# EAGLE schematic blinkenkringel (EAGLE 6.4)
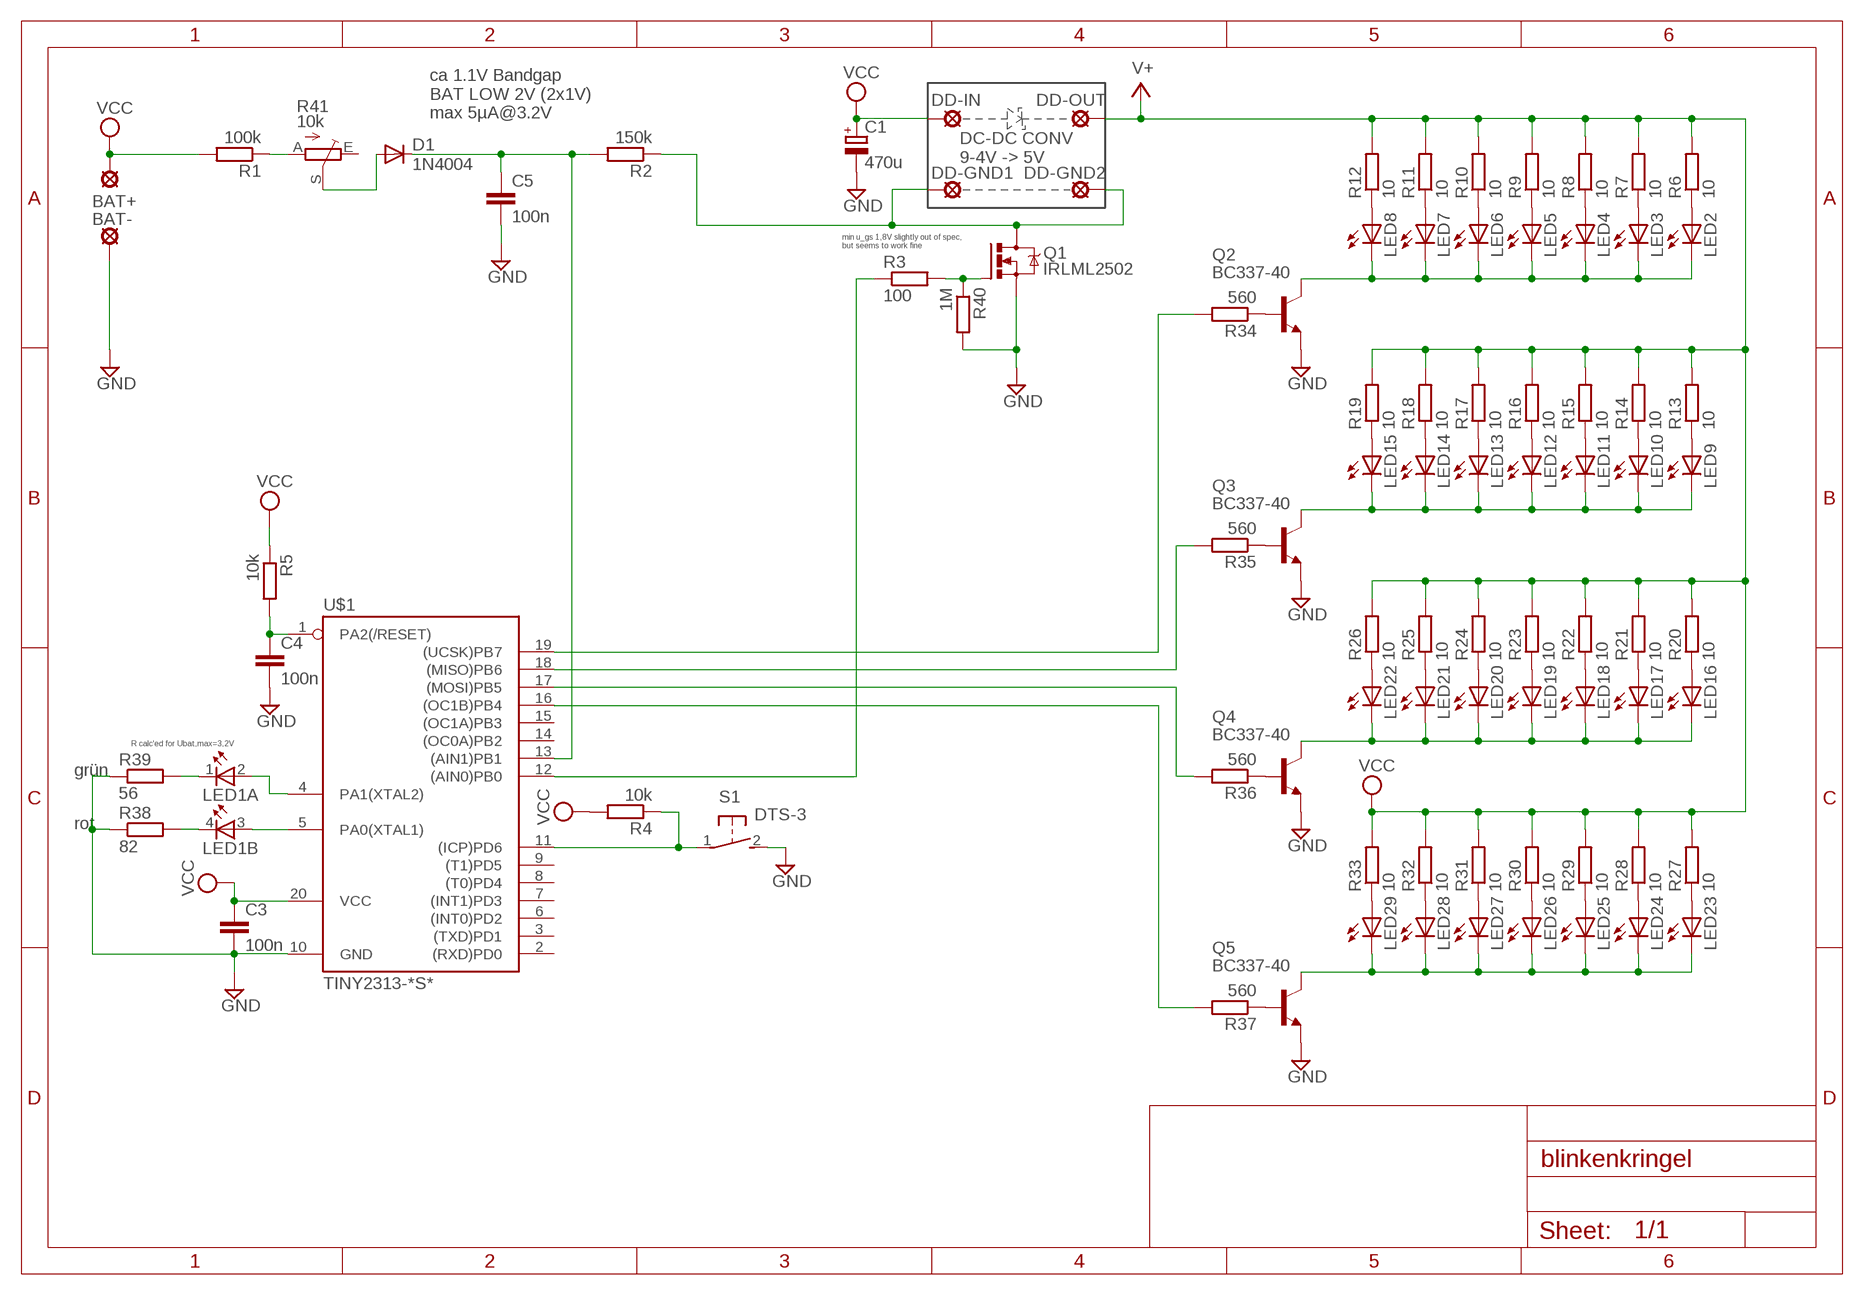
[diagram p0: schematic, sheet 1]

## Parts
BAT+  MCS10B  [MCS10B]
BAT-  MCS10B  [MCS10B]
C1  470u  CPOL-EUE5-8.5  [E5-8,5]
C3  100n  C-EU025-024X044  [C025-024X044]
C4  100n  C-EU025-024X044  [C025-024X044]
C5  100n  C-EU025-024X044  [C025-024X044]
D1  1N4004  [DO41-10]
DD-GND1  MCS10B  [MCS10B]
DD-GND2  MCS10B  [MCS10B]
DD-IN  MCS10B  [MCS10B]
DD-OUT  MCS10B  [MCS10B]
LED1  TOPLED-2--  [P-LCC-4-2]
LED2  LEDCHIPLED_0805  [CHIPLED_0805]
LED3  LEDCHIPLED_0805  [CHIPLED_0805]
LED4  LEDCHIPLED_0805  [CHIPLED_0805]
LED5  LEDCHIPLED_0805  [CHIPLED_0805]
LED6  LEDCHIPLED_0805  [CHIPLED_0805]
LED7  LEDCHIPLED_0805  [CHIPLED_0805]
LED8  LEDCHIPLED_0805  [CHIPLED_0805]
LED9  LEDCHIPLED_0805  [CHIPLED_0805]
LED10  LEDCHIPLED_0805  [CHIPLED_0805]
LED11  LEDCHIPLED_0805  [CHIPLED_0805]
LED12  LEDCHIPLED_0805  [CHIPLED_0805]
LED13  LEDCHIPLED_0805  [CHIPLED_0805]
LED14  LEDCHIPLED_0805  [CHIPLED_0805]
LED15  LEDCHIPLED_0805  [CHIPLED_0805]
LED16  LEDCHIPLED_0805  [CHIPLED_0805]
LED17  LEDCHIPLED_0805  [CHIPLED_0805]
LED18  LEDCHIPLED_0805  [CHIPLED_0805]
LED19  LEDCHIPLED_0805  [CHIPLED_0805]
LED20  LEDCHIPLED_0805  [CHIPLED_0805]
LED21  LEDCHIPLED_0805  [CHIPLED_0805]
LED22  LEDCHIPLED_0805  [CHIPLED_0805]
LED23  LEDCHIPLED_0805  [CHIPLED_0805]
LED24  LEDCHIPLED_0805  [CHIPLED_0805]
LED25  LEDCHIPLED_0805  [CHIPLED_0805]
LED26  LEDCHIPLED_0805  [CHIPLED_0805]
LED27  LEDCHIPLED_0805  [CHIPLED_0805]
LED28  LEDCHIPLED_0805  [CHIPLED_0805]
LED29  LEDCHIPLED_0805  [CHIPLED_0805]
Q1  IRLML2502  [MICRO3]
Q2  BC337-40  [TO92]
Q3  BC337-40  [TO92]
Q4  BC337-40  [TO92]
Q5  BC337-40  [TO92]
R1  100k  R-EU_0207/7  [0207/7]
R2  150k  R-EU_0207/7  [0207/7]
R3  100  R-EU_0207/7  [0207/7]
R4  10k  R-EU_0207/7  [0207/7]
R5  10k  R-EU_0207/7  [0207/7]
R6  10  R-EU_0207/7  [0207/7]
R7  10  R-EU_0207/7  [0207/7]
R8  10  R-EU_0207/7  [0207/7]
R9  10  R-EU_0207/7  [0207/7]
R10  10  R-EU_0207/7  [0207/7]
R11  10  R-EU_0207/7  [0207/7]
R12  10  R-EU_0207/7  [0207/7]
R13  10  R-EU_0207/7  [0207/7]
R14  10  R-EU_0207/7  [0207/7]
R15  10  R-EU_0207/7  [0207/7]
R16  10  R-EU_0207/7  [0207/7]
R17  10  R-EU_0207/7  [0207/7]
R18  10  R-EU_0207/7  [0207/7]
R19  10  R-EU_0207/7  [0207/7]
R20  10  R-EU_0207/7  [0207/7]
R21  10  R-EU_0207/7  [0207/7]
R22  10  R-EU_0207/7  [0207/7]
R23  10  R-EU_0207/7  [0207/7]
R24  10  R-EU_0207/7  [0207/7]
R25  10  R-EU_0207/7  [0207/7]
R26  10  R-EU_0207/7  [0207/7]
R27  10  R-EU_0207/7  [0207/7]
R28  10  R-EU_0207/7  [0207/7]
R29  10  R-EU_0207/7  [0207/7]
R30  10  R-EU_0207/7  [0207/7]
R31  10  R-EU_0207/7  [0207/7]
R32  10  R-EU_0207/7  [0207/7]
R33  10  R-EU_0207/7  [0207/7]
R34  560  R-EU_0207/7  [0207/7]
R35  560  R-EU_0207/7  [0207/7]
R36  560  R-EU_0207/7  [0207/7]
R37  560  R-EU_0207/7  [0207/7]
R38  82  R-EU_0207/7  [0207/7]
R39  56  R-EU_0207/7  [0207/7]
R40  1M  R-EU_0207/7  [0207/7]
R41  10k  TRIM_EU-CA9V  [CA9V]
S1  DTS-3  [DTS-3]
U$1  TINY2313-*S*  [SO20L$]

## Nets
GND: BAT-.MP C1.- C3.2 C4.2 C5.2 Q1.2(S) Q2.1(E) Q3.1(E) Q4.1(E) Q5.1(E) R38.1 R39.1 R40.2 S1.2 U$1.10(GND)
N$1: C4.1 R5.2 U$1.1(PA2(/RESET))
N$2: LED2.A R6.1
N$3: LED3.A R7.1
N$4: C5.1 D1.C R2.2 U$1.13((AIN1)PB1)
N$5: DD-GND1.MP DD-GND2.MP Q1.3(D) R2.1
N$6: Q1.1(G) R3.2 R40.1
N$7: LED4.A R8.1
N$8: LED5.A R9.1
N$9: LED6.A R10.1
N$10: LED7.A R11.1
N$11: LED8.A R12.1
N$12: Q2.2(B) R34.1
N$13: LED9.C LED10.C LED11.C LED12.C LED13.C LED14.C LED15.C Q3.3(C)
N$14: LED9.A R13.1
N$15: LED10.A R14.1
N$16: LED11.A R15.1
N$17: LED12.A R16.1
N$18: LED13.A R17.1
N$19: LED14.A R18.1
N$20: LED15.A R19.1
N$21: Q3.2(B) R35.1
N$22: LED16.C LED17.C LED18.C LED19.C LED20.C LED21.C LED22.C Q4.3(C)
N$23: LED16.A R20.1
N$24: LED17.A R21.1
N$25: LED18.A R22.1
N$26: LED19.A R23.1
N$27: LED20.A R24.1
N$28: LED21.A R25.1
N$29: LED22.A R26.1
N$30: Q4.2(B) R36.1
N$31: LED23.C LED24.C LED25.C LED26.C LED27.C LED28.C LED29.C Q5.3(C)
N$32: LED23.A R27.1
N$33: LED24.A R28.1
N$34: LED25.A R29.1
N$35: LED26.A R30.1
N$36: LED27.A R31.1
N$37: LED28.A R32.1
N$38: LED29.A R33.1
N$39: Q5.2(B) R37.1
N$40: R36.2 U$1.17((MOSI)PB5)
N$41: LED2.C LED3.C LED4.C LED5.C LED6.C LED7.C LED8.C Q2.3(C)
N$42: R35.2 U$1.18((MISO)PB6)
N$43: R34.2 U$1.19((UCSK)PB7)
N$44: LED1.3(B:A) U$1.5(PA0(XTAL1))
N$45: LED1.2(A:A) U$1.4(PA1(XTAL2))
N$46: R4.1 S1.1 U$1.11((ICP)PD6)
N$47: R3.1 U$1.12((AIN0)PB0)
N$48: R37.2 U$1.16((OC1B)PB4)
N$49: LED1.4(B:C) R38.2
N$50: LED1.1(A:C) R39.2
N$51: R1.1 R41.A
N$52: D1.A R41.S
V+: DD-OUT.MP R6.2 R7.2 R8.2 R9.2 R10.2 R11.2 R12.2 R13.2 R14.2 R15.2 R16.2 R17.2 R18.2 R19.2 R20.2 R21.2 R22.2 R23.2 R24.2 R25.2 R26.2 R27.2 R28.2 R29.2 R30.2 R31.2 R32.2 R33.2 ; supply symbol labelled VCC
VCC: BAT+.MP C1.+ C3.1 DD-IN.MP R1.2 R4.2 R5.1 U$1.20(VCC)
Unconnected: R41.E U$1.2((RXD)PD0) U$1.3((TXD)PD1) U$1.6((INT0)PD2) U$1.7((INT1)PD3) U$1.8((T0)PD4) U$1.9((T1)PD5) U$1.14((OC0A)PB2) U$1.15((OC1A)PB3)

## Notes on the sheet
- ca 1.1V Bandgap
  BAT LOW 2V (2x1V)
  max 5µA@3.2V
- DC-DC CONV
  9-4V -> 5V
- min u_gs 1,8V slightly out of spec,
  but seems to work fine
- R calc'ed for Ubat,max=3,2V
- grün
- rot

## Library data of the parts
BAT+ BAT- DD-GND1 DD-GND2 DD-IN DD-OUT = solpad:MCS10B: SOLDER PAD MC S1, distributor Buerklin, 15F505
C1 = rcl:CPOL-EU: POLARIZED CAPACITOR, European symbol
C3-C5 = rcl:C-EU: CAPACITOR, European symbol
D1 = diode:1N4004: DIODE general purpose rectifier, 1 A
LED1 = led:TOPLED-2-: Multi TOPLED® (two color) LG T672, LP T672 LSY T67B LSW T67C LSY T675 LSY T676 LSG T677 LSG T770 Source: http://www.osram.convergy.de/
LED2-LED29 = led:LED: LED OSRAM: - CHIPLED LG R971, LG N971, LY N971, LG Q971, LY Q971, LO R971, LY R971 LH N974, LH R974 LS Q976, LO Q976, LY Q976 LO Q996 - Hyper CHIPLED LW Q18S LB Q993, LB Q99A, LB R99A - SideLED LS A670, LO A670, LY A670, LG A670, LP A670 LB A673, LV A673, LT A673, LW A673 LH A674 LY A675 LS A676, LA A676, LO A676, LY A676, LW A676 LS A679, LY A679, LG A679 - Hyper Micro SIDELED® LS Y876, LA Y876, LO Y876, LY Y876 LT Y87S - SmartLED LW L88C, LW L88S LB L89C, LB L89S, LG L890 LS L89K, LO L89K, LY L89K LS L896, LA L896, LO L896, LY L896 - TOPLED LS T670, LO T670, LY T670, LG T670, LP T670 LSG T670, LSP T670, LSY T670, LOP T670, LYG T670 LG T671, LOG T671, LSG T671 LB T673, LV T673, LT T673, LW T673 LH T674 LS T676, LA T676, LO T676, LY T676, LB T676, LH T676, LSB T676, LW T676 LB T67C, LV T67C, LT T67C, LS T67K, LO T67K, LY T67K, LW E67C LS E67B, LA E67B, LO E67B, LY E67B, LB E67C, LV E67C, LT E67C LW T67C LS T679, LY T679, LG T679 LS T770, LO T770, LY T770, LG T770, LP T770 LB T773, LV T773, LT T773, LW T773 LH T774 LS E675, LA E675, LY E675, LS T675 LS T776, LA T776, LO T776, LY T776, LB T776 LHGB T686 LT T68C, LB T68C - Hyper Mini TOPLED® LB M676 - Mini TOPLED Santana® LG M470 LS M47K, LO M47K, LY M47K Source: http://www.osram.convergy.de LUXEON: - LUMILED® LXK2-PW12-R00, LXK2-PW12-S00, LXK2-PW14-U00, LXK2-PW14-V00 LXK2-PM12-R00, LXK2-PM12-S00, LXK2-PM14-U00 LXK2-PE12-Q00, LXK2-PE12-R00, LXK2-PE12-S00, LXK2-PE14-T00, LXK2-PE14-U00 LXK2-PB12-K00, LXK2-PB12-L00, LXK2-PB12-M00, LXK2-PB14-N00, LXK2-PB14-P00, LXK2-PB14-Q00 LXK2-PR12-L00, LXK2-PR12-M00, LXK2-PR14-Q00, LXK2-PR14-R00 LXK2-PD12-Q00, LXK2-PD12-R00, LXK2-PD12-S00 LXK2-PH12-R00, LXK2-PH12-S00 LXK2-PL12-P00, LXK2-PL12-Q00, LXK2-PL12-R00 Source: www.luxeon.com KINGBRIGHT: KA-3528ASYC Source: www.kingbright.com
Q1 = mosfet:IRLML2502: HEXFET N-Channel Power MOSFET http://www.irf.com/product-info/datasheets/data/irlml2502.pdf
Q2-Q5 = transistor-npn:BC337*: NPN Transistor
R1-R40 = rcl:R-EU_: RESISTOR, European symbol
R41 = pot:TRIM_EU-: POTENTIOMETER
S1 = switch-tact:DTS-3
U$1 = avr-7:TINY2313*: Atmel Tiny2313 2K Flash, 128 bytes EEPROM, 128 bytes RAM